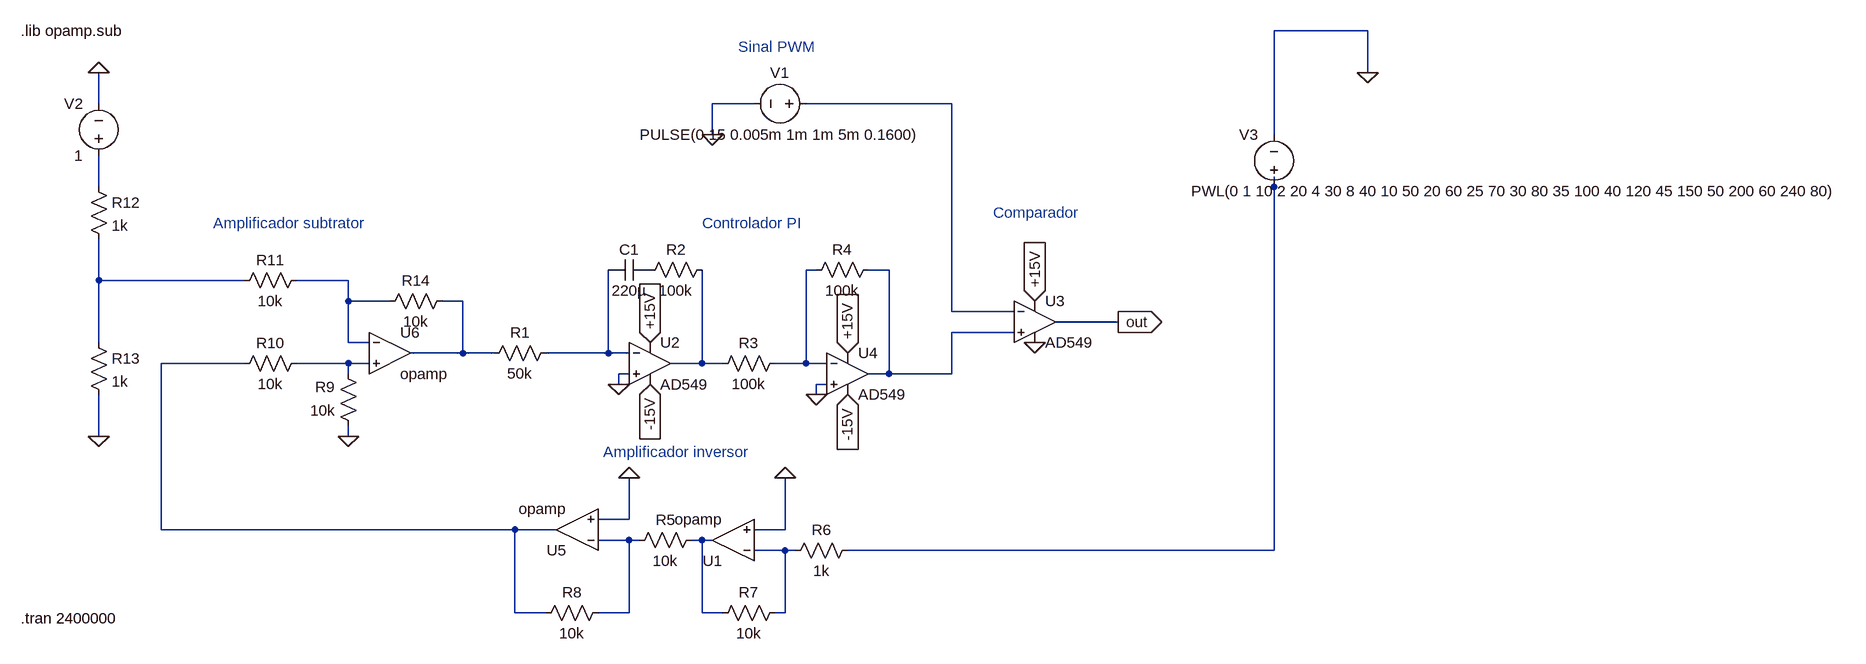
[diagram p0: schematic simulação circuito 1.asc]
simulação circuito 1.asc, the LTspice schematic file:
Version 4
SHEET 1 2260 1172
WIRE 1520 -256 1376 -256
WIRE 1520 -192 1520 -256
WIRE -432 -144 -432 -192
WIRE 576 -144 512 -144
WIRE 880 -144 656 -144
WIRE 512 -96 512 -144
WIRE 1376 -96 1376 -256
WIRE -432 -16 -432 -64
WIRE 1376 -16 1376 -32
WIRE 672 112 656 112
WIRE 784 112 752 112
WIRE -432 128 -432 64
WIRE -208 128 -432 128
WIRE -48 128 -128 128
WIRE -48 160 -48 128
WIRE 16 160 -48 160
WIRE 128 160 96 160
WIRE 880 176 880 -144
WIRE 976 176 880 176
WIRE 1136 192 1040 192
WIRE 976 208 880 208
WIRE -432 224 -432 128
WIRE -48 224 -48 160
WIRE -16 224 -48 224
WIRE 128 240 128 160
WIRE 128 240 48 240
WIRE 176 240 128 240
WIRE 352 240 352 112
WIRE 352 240 256 240
WIRE 384 240 352 240
WIRE -208 256 -336 256
WIRE -48 256 -128 256
WIRE -16 256 -48 256
WIRE 496 256 496 112
WIRE 496 256 448 256
WIRE 528 256 496 256
WIRE 656 256 656 112
WIRE 656 256 608 256
WIRE 688 256 656 256
WIRE -48 272 -48 256
WIRE 384 272 368 272
WIRE 784 272 784 112
WIRE 784 272 752 272
WIRE 880 272 880 208
WIRE 880 272 784 272
WIRE 368 288 368 272
WIRE 688 288 672 288
WIRE 672 304 672 288
WIRE -432 368 -432 304
WIRE -48 368 -48 352
WIRE 384 496 384 432
WIRE 384 496 336 496
WIRE -336 512 -336 256
WIRE 208 512 -336 512
WIRE 272 512 208 512
WIRE 624 512 624 432
WIRE 624 512 576 512
WIRE 384 528 336 528
WIRE 400 528 384 528
WIRE 496 528 480 528
WIRE 512 528 496 528
WIRE 624 544 576 544
WIRE 640 544 624 544
WIRE 1376 544 1376 -16
WIRE 1376 544 720 544
WIRE 208 640 208 512
WIRE 256 640 208 640
WIRE 384 640 384 528
WIRE 384 640 336 640
WIRE 496 640 496 528
WIRE 528 640 496 640
WIRE 624 640 624 544
WIRE 624 640 608 640
FLAG 624 432 0
FLAG 384 432 0
FLAG -48 368 0
FLAG -432 368 0
FLAG 512 -96 0
FLAG -432 -192 0
FLAG 1520 -192 0
FLAG 368 288 0
FLAG 672 304 0
FLAG 416 224 +15V
IOPIN 416 224 In
FLAG 720 240 +15V
IOPIN 720 240 In
FLAG 416 288 -15V
IOPIN 416 288 In
FLAG 720 304 -15V
IOPIN 720 304 In
FLAG 1008 160 +15V
IOPIN 1008 160 In
FLAG 1008 224 0
FLAG 1136 192 out
IOPIN 1136 192 Out
SYMBOL OpAmps\\opamp 544 592 R180
SYMATTR InstName U1
SYMBOL OpAmps\\opamp 304 576 R180
SYMATTR InstName U5
SYMBOL res 496 512 R90
WINDOW 0 0 56 VBottom 2
WINDOW 3 32 56 VTop 2
SYMATTR InstName R5
SYMATTR Value 10k
SYMBOL res 736 528 R90
WINDOW 0 0 56 VBottom 2
WINDOW 3 32 56 VTop 2
SYMATTR InstName R6
SYMATTR Value 1k
SYMBOL res 624 624 R90
WINDOW 0 0 56 VBottom 2
WINDOW 3 32 56 VTop 2
SYMATTR InstName R7
SYMATTR Value 10k
SYMBOL res 352 624 R90
WINDOW 0 0 56 VBottom 2
WINDOW 3 32 56 VTop 2
SYMATTR InstName R8
SYMATTR Value 10k
SYMBOL OpAmps\\opamp 16 176 R0
SYMATTR InstName U6
SYMBOL res -32 368 R180
WINDOW 0 36 76 Left 2
WINDOW 3 36 40 Left 2
SYMATTR InstName R9
SYMATTR Value 10k
SYMBOL res -112 240 R90
WINDOW 0 0 56 VBottom 2
WINDOW 3 32 56 VTop 2
SYMATTR InstName R10
SYMATTR Value 10k
SYMBOL res -112 112 R90
WINDOW 0 0 56 VBottom 2
WINDOW 3 32 56 VTop 2
SYMATTR InstName R11
SYMATTR Value 10k
SYMBOL res -448 -32 R0
SYMATTR InstName R12
SYMATTR Value 1k
SYMBOL res -448 208 R0
SYMATTR InstName R13
SYMATTR Value 1k
SYMBOL voltage 672 -144 R90
WINDOW 0 -32 56 VBottom 2
WINDOW 3 32 56 VTop 2
WINDOW 123 0 0 Left 0
WINDOW 39 0 0 Left 0
SYMATTR InstName V1
SYMATTR Value PULSE(0 15 0.005m 1m 1m 5m 0.1600)
SYMBOL res 112 144 R90
WINDOW 0 0 56 VBottom 2
WINDOW 3 32 56 VTop 2
SYMATTR InstName R14
SYMATTR Value 10k
SYMBOL voltage -432 -48 R180
WINDOW 0 24 96 Left 2
WINDOW 3 24 16 Left 2
WINDOW 123 0 0 Left 0
WINDOW 39 0 0 Left 0
SYMATTR InstName V2
SYMATTR Value 1
SYMBOL voltage 1376 0 R180
WINDOW 0 24 96 Left 2
WINDOW 3 -879 9 Left 2
WINDOW 123 0 0 Left 0
WINDOW 39 0 0 Left 0
SYMATTR InstName V3
SYMATTR Value PWL(0 1 10 2 20 4 30 8 40 10 50 20 60 25 70 30 80 35 100 40 120 45 150 50 200 60 240 80)
SYMBOL OpAmps\\AD549 416 192 R0
SYMATTR InstName U2
SYMBOL OpAmps\\AD549 720 208 R0
SYMATTR InstName U4
SYMBOL res 272 224 R90
WINDOW 0 0 56 VBottom 2
WINDOW 3 32 56 VTop 2
SYMATTR InstName R1
SYMATTR Value 50k
SYMBOL res 512 96 R90
WINDOW 0 0 56 VBottom 2
WINDOW 3 32 56 VTop 2
SYMATTR InstName R2
SYMATTR Value 100k
SYMBOL res 624 240 R90
WINDOW 0 0 56 VBottom 2
WINDOW 3 32 56 VTop 2
SYMATTR InstName R3
SYMATTR Value 100k
SYMBOL res 768 96 R90
WINDOW 0 0 56 VBottom 2
WINDOW 3 32 56 VTop 2
SYMATTR InstName R4
SYMATTR Value 100k
SYMBOL cap 416 96 R90
WINDOW 0 0 32 VBottom 2
WINDOW 3 32 32 VTop 2
SYMATTR InstName C1
SYMATTR Value 220µ
SYMBOL OpAmps\\AD549 1008 128 R0
SYMATTR InstName U3
TEXT -552 -256 Left 2 !.lib opamp.sub
TEXT 944 24 Left 2 ;Comparador
TEXT 552 -232 Left 2 ;Sinal PWM
TEXT 344 392 Left 2 ;Amplificador inversor
TEXT -256 40 Left 2 ;Amplificador subtrator
TEXT -552 648 Left 2 !.tran 2400000
TEXT 496 40 Left 2 ;Controlador PI

The netlist it stands for:
* simulação circuito 1.asc
XU1 N015 0 N014 opamp Aol=100K GBW=10Meg  ; pins invin noninvin out
XU5 N013 0 N010 opamp Aol=100K GBW=10Meg  ; pins invin noninvin out
R5 N014 N013 10k
R6 N003 N015 1k
R7 N015 N014 10k
R8 N013 N010 10k
XU6 N007 N011 N008 opamp Aol=100K GBW=10Meg  ; pins invin noninvin out
R9 0 N011 10k
R10 N011 N010 10k
R11 N007 N006 10k
R12 N002 N006 1k
R13 N006 0 1k
V1 N001 0 PULSE(0 15 0.005m 1m 1m 5m 0.1600)
R14 N008 N007 10k
V2 N002 0 1
V3 N003 0 PWL(0 1 10 2 20 4 30 8 40 10 50 20 60 25 70 30 80 35 100 40 120 45 150 50 200 60 240 80)
XU2 0 N009 +15V -15V N012 AD549  ; pins In+ In- V+ V- OUT
XU4 0 N004 +15V -15V N005 AD549  ; pins In+ In- V+ V- OUT
R1 N009 N008 50k
R2 N012 P001 100k
R3 N004 N012 100k
R4 N005 N004 100k
C1 P001 N009 220µ
XU3 N005 N001 +15V 0 out AD549  ; pins In+ In- V+ V- OUT
.lib opamp.sub
* Comparador
* Sinal PWM
* Amplificador inversor
* Amplificador subtrator
.tran 2400000
* Controlador PI
.backanno
.end